# Altium schematic sheet Memory.SchDoc
size A
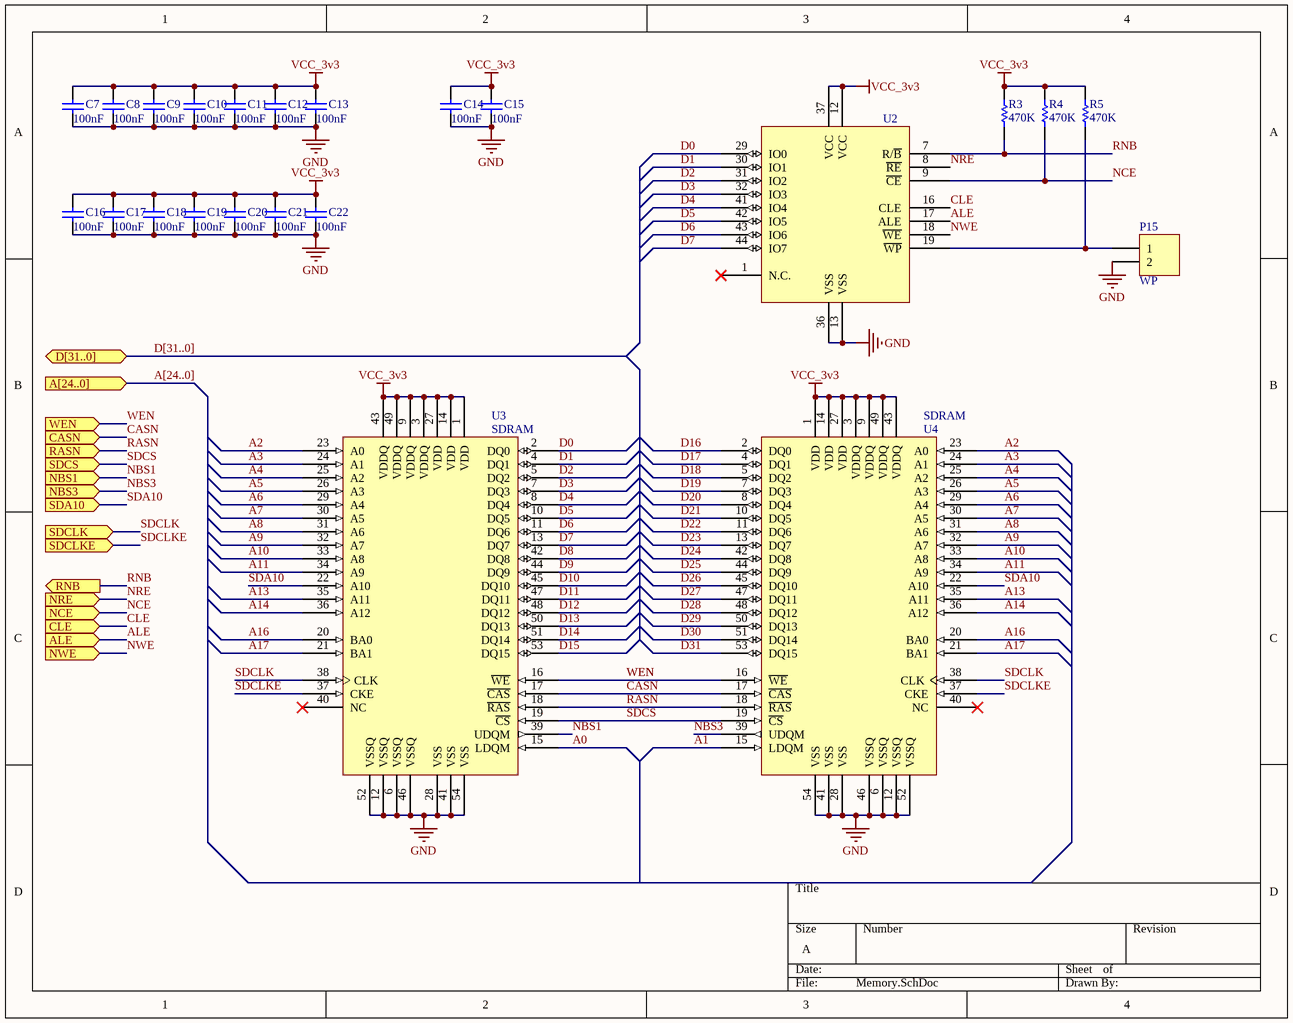
[diagram p0: Memory.SchDoc]

## Parts
C7  value 100nF  [0603PKG]  (hidden comment: Cap)
C8  value 100nF  [0603PKG]  (hidden comment: Cap)
C9  value 100nF  [0603PKG]  (hidden comment: Cap)
C10  value 100nF  [0603PKG]  (hidden comment: Cap)
C11  value 100nF  [0603PKG]  (hidden comment: Cap)
C12  value 100nF  [0603PKG]  (hidden comment: Cap)
C13  value 100nF  [0603PKG]  (hidden comment: Cap)
C14  value 100nF  [C0805]  (hidden comment: Cap)
C15  value 100nF  [C0805]  (hidden comment: Cap)
C16  value 100nF  [0603PKG]  (hidden comment: Cap)
C17  value 100nF  [0603PKG]  (hidden comment: Cap)
C18  value 100nF  [0603PKG]  (hidden comment: Cap)
C19  value 100nF  [0603PKG]  (hidden comment: Cap)
C20  value 100nF  [0603PKG]  (hidden comment: Cap)
C21  value 100nF  [0603PKG]  (hidden comment: Cap)
C22  value 100nF  [0603PKG]  (hidden comment: Cap)
P15  WP  [HDR1X2]
R3  value 470K  [C0805]  (hidden comment: Res Semi)
R4  value 470K  [C0805]  (hidden comment: Res Semi)
R5  value 470K  [C0805]  (hidden comment: Res Semi)
U2  NAND FLASH  [TSSOP-48]  (value not drawn)
U3  SDRAM  [TSOP54_Pin]
U4  SDRAM  [TSOP54_Pin]

## Ports
A[24..0] (in), ALE (in), CASN (in), CLE (in), D[31..0], NBS1 (in), NBS3 (in), NCE (in), NRE (in), NWE (in), RASN (in), RNB (out), SDA10 (in), SDCLK (in), SDCLKE (in), SDCS (in), WEN (in)

## Nets
GND: C7.1 C8.1 C9.1 C10.1 C11.1 C12.1 C13.1 C14.1 C15.1 C16.1 C17.1 C18.1 C19.1 C20.1 C21.1 C22.1 P15.2 U2.13(VSS) U2.36(VSS) U3.6(VSSQ) U3.12(VSSQ) U3.28(VSS) U3.41(VSS) U3.46(VSSQ) U3.52(VSSQ) U3.54(VSS) U4.6(VSSQ) U4.12(VSSQ) U4.28(VSS) U4.41(VSS) U4.46(VSSQ) U4.52(VSSQ) U4.54(VSS)
VCC_3v3: C7.2 C8.2 C9.2 C10.2 C11.2 C12.2 C13.2 C14.2 C15.2 C16.2 C17.2 C18.2 C19.2 C20.2 C21.2 C22.2 R3.1 R4.1 R5.1 U2.12(VCC) U2.37(VCC) U3.1(VDD) U3.3(VDDQ) U3.9(VDDQ) U3.14(VDD) U3.27(VDD) U3.43(VDDQ) U3.49(VDDQ) U4.1(VDD) U4.3(VDDQ) U4.9(VDDQ) U4.14(VDD) U4.27(VDD) U4.43(VDDQ) U4.49(VDDQ)
A0: U3.15(LDQM)
A1: U4.15(LDQM)
A2: U3.23(A0) U4.23(A0)
A3: U3.24(A1) U4.24(A1)
A4: U3.25(A2) U4.25(A2)
A5: U3.26(A3) U4.26(A3)
A6: U3.29(A4) U4.29(A4)
A7: U3.30(A5) U4.30(A5)
A8: U3.31(A6) U4.31(A6)
A9: U3.32(A7) U4.32(A7)
A10: U3.33(A8) U4.33(A8)
A11: U3.34(A9) U4.34(A9)
A13: U3.35(A11) U4.35(A11)
A14: U3.36(A12) U4.36(A12)
A16: U3.20(BA0) U4.20(BA0)
A17: U3.21(BA1) U4.21(BA1)
ALE: U2.17(ALE) ; port ALE
CASN: U3.17(~{CAS}) U4.17(~{CAS}) ; port CASN
CLE: U2.16(CLE) ; port CLE
D0: U2.29(IO0) U3.2(DQ0)
D1: U2.30(IO1) U3.4(DQ1)
D2: U2.31(IO2) U3.5(DQ2)
D3: U2.32(IO3) U3.7(DQ3)
D4: U2.41(IO4) U3.8(DQ4)
D5: U2.42(IO5) U3.10(DQ5)
D6: U2.43(IO6) U3.11(DQ6)
D7: U2.44(IO7) U3.13(DQ7)
D8: U3.42(DQ8)
D9: U3.44(DQ9)
D10: U3.45(DQ10)
D11: U3.47(DQ11)
D12: U3.48(DQ12)
D13: U3.50(DQ13)
D14: U3.51(DQ14)
D15: U3.53(DQ15)
D16: U4.2(DQ0)
D17: U4.4(DQ1)
D18: U4.5(DQ2)
D19: U4.7(DQ3)
D20: U4.8(DQ4)
D21: U4.10(DQ5)
D22: U4.11(DQ6)
D23: U4.13(DQ7)
D24: U4.42(DQ8)
D25: U4.44(DQ9)
D26: U4.45(DQ10)
D27: U4.47(DQ11)
D28: U4.48(DQ12)
D29: U4.50(DQ13)
D30: U4.51(DQ14)
D31: U4.53(DQ15)
NBS1: U3.39(UDQM) ; port NBS1
NBS3: U4.39(UDQM) ; port NBS3
NCE: R4.2 U2.9(~{CE}) ; port NCE
NRE: U2.8(~{RE}) ; port NRE
NWE: U2.18(~{WE}) ; port NWE
RASN: U3.18(~{RAS}) U4.18(~{RAS}) ; port RASN
RNB: R3.2 U2.7(R/~{B}) ; port RNB
SDA10: U3.22(A10) U4.22(A10) ; port SDA10
SDCLK: U3.38(CLK) U4.38(CLK) ; port SDCLK
SDCLKE: U3.37(CKE) U4.37(CKE) ; port SDCLKE
SDCS: U3.19(~{CS}) U4.19(~{CS}) ; port SDCS
WEN: U3.16(~{WE}) U4.16(~{WE}) ; port WEN
NetP15_1: P15.1 R5.2 U2.19(~{WP})

Not connected (* = marked no-connect by the designer): U2 1(N.C.)*; U3 40(NC)*; U4 40(NC)*

## Buses and harness runs
bus A[24..0] = port A[24..0]
bus D[31..0] = port D[31..0]

## Library data of the parts
C7-C22 = Cap: Capacitor; Published: 8-Jun-2000; LatestRevisionDate: 17-Jul-2002; LatestRevisionNote: Re-released for DXP Platform.; PackageReference: RAD-0.3; Publisher: Altium Limited; PackageDescription: Radial Cap, Thru-Hole; 2 Leads; 0.3 in Pin Spacing
P15 = Header 2: Header, 2-Pin; LatestRevisionDate: 17-Jul-2002; LatestRevisionNote: Re-released for DXP Platform.; Publisher: Altium Limited
R3-R5 = Res Semi: Semiconductor Resistor; Published: 8-Jun-2000; LatestRevisionDate: 17-Jul-2002; LatestRevisionNote: Re-released for DXP Platform.; PackageReference: AXIAL-0.5; Publisher: Altium Limited; PackageDescription: Axial Device, Thru-Hole; 2 Leads; 0.5 in Pin Spacing
U2 = K9F2G08U0A
U3 U4 = K4S561632C